# EAGLE schematic plant (EAGLE 6.4)
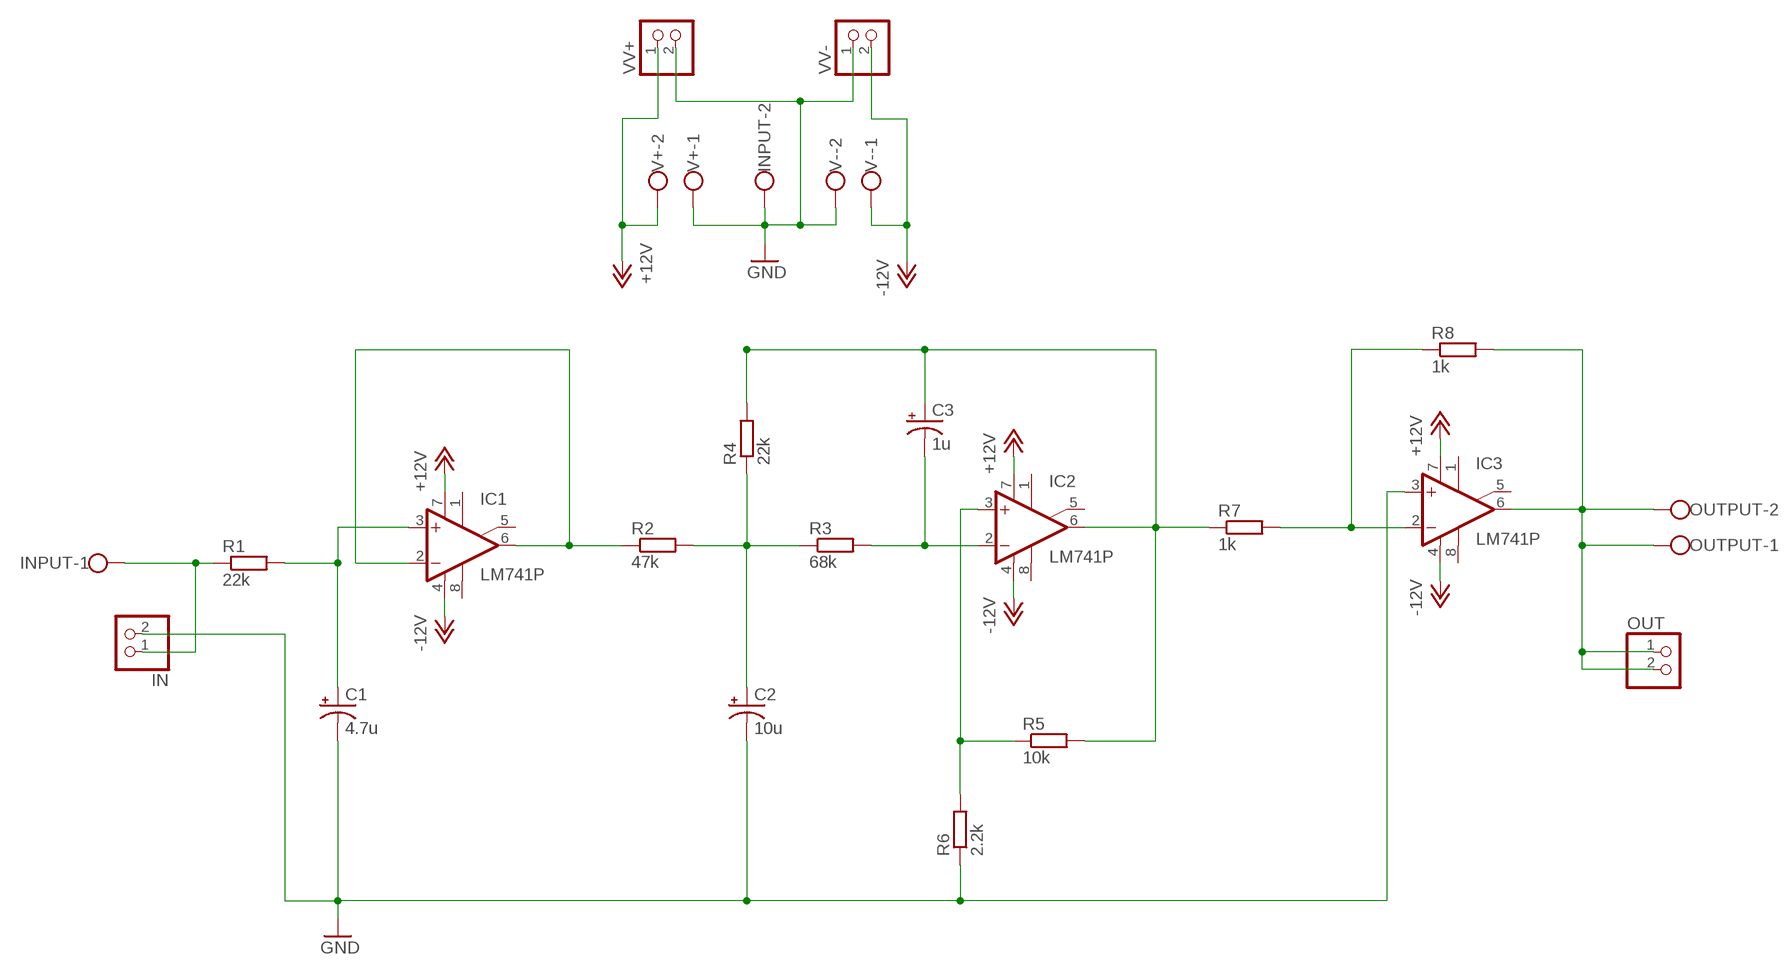
[diagram p0: schematic, sheet 1]

## Parts
C1  4.7u  CPOL-USE2.5-6  [E2,5-6]
C2  10u  CPOL-USE2.5-6  [E2,5-6]
C3  1u  CPOL-USE2.5-6  [E2,5-6]
IC1  LM741P  [DIL08]
IC2  LM741P  [DIL08]
IC3  LM741P  [DIL08]
IN  PINHD-1X2  [1X02]
INPUT  W237-102  [W237-102]
OUT  PINHD-1X2  [1X02]
OUTPUT  W237-102  [W237-102]
R1  22k  R-EU_0207/7  [0207/7]
R2  47k  R-EU_0207/7  [0207/7]
R3  68k  R-EU_0207/7  [0207/7]
R4  22k  R-EU_0207/7  [0207/7]
R5  10k  R-EU_0207/7  [0207/7]
R6  2.2k  R-EU_0207/7  [0207/7]
R7  1k  R-EU_0207/7  [0207/7]
R8  1k  R-EU_0207/7  [0207/7]
V+  W237-102  [W237-102]
V-  W237-102  [W237-102]
VV+  PINHD-1X2  [1X02]
VV-  PINHD-1X2  [1X02]

## Nets
+12V: IC1.7(V+) IC2.7(V+) IC3.7(V+) V+.2 VV+.1
-12V: IC1.4(V-) IC2.4(V-) IC3.4(V-) V-.1 VV-.2
GND: C1.- C2.- IC3.3(+IN) IN.2 INPUT.2 R6.1 V+.1 V-.2 VV+.2 VV-.1
N$1: C1.+ IC1.3(+IN) R1.2
N$2: IC1.2(-IN) IC1.6(OUT) R2.1
N$3: C2.+ R2.2 R3.1 R4.1
N$4: C3.- IC2.2(-IN) R3.2
N$5: C3.+ IC2.6(OUT) R4.2 R5.2 R7.1
N$7: IC3.2(-IN) R7.2 R8.1
N$8: IC3.6(OUT) OUT.1 OUT.2 OUTPUT.1 OUTPUT.2 R8.2
N$9: IC2.3(+IN) R5.1 R6.2
N$12: IN.1 INPUT.1 R1.1
Unconnected: IC1.1(ON1) IC1.5(ON2) IC1.8(OPT) IC2.1(ON1) IC2.5(ON2) IC2.8(OPT) IC3.1(ON1) IC3.5(ON2) IC3.8(OPT)

## Library data of the parts
C1-C3 = rcl:CPOL-US: POLARIZED CAPACITOR, American symbol
IC1-IC3 = linear:*741: OP AMP
IN OUT VV+ VV- = pinhead:PINHD-1X2: PIN HEADER
INPUT OUTPUT V+ V- = con-wago-500:W237-102: WAGO SCREW CLAMP; MPN: 237-102; OC_FARNELL: unknown; OC_NEWARK: 70K9898
R1-R8 = rcl:R-EU_: RESISTOR, European symbol